# EAGLE schematic untitled (EAGLE 6.1)
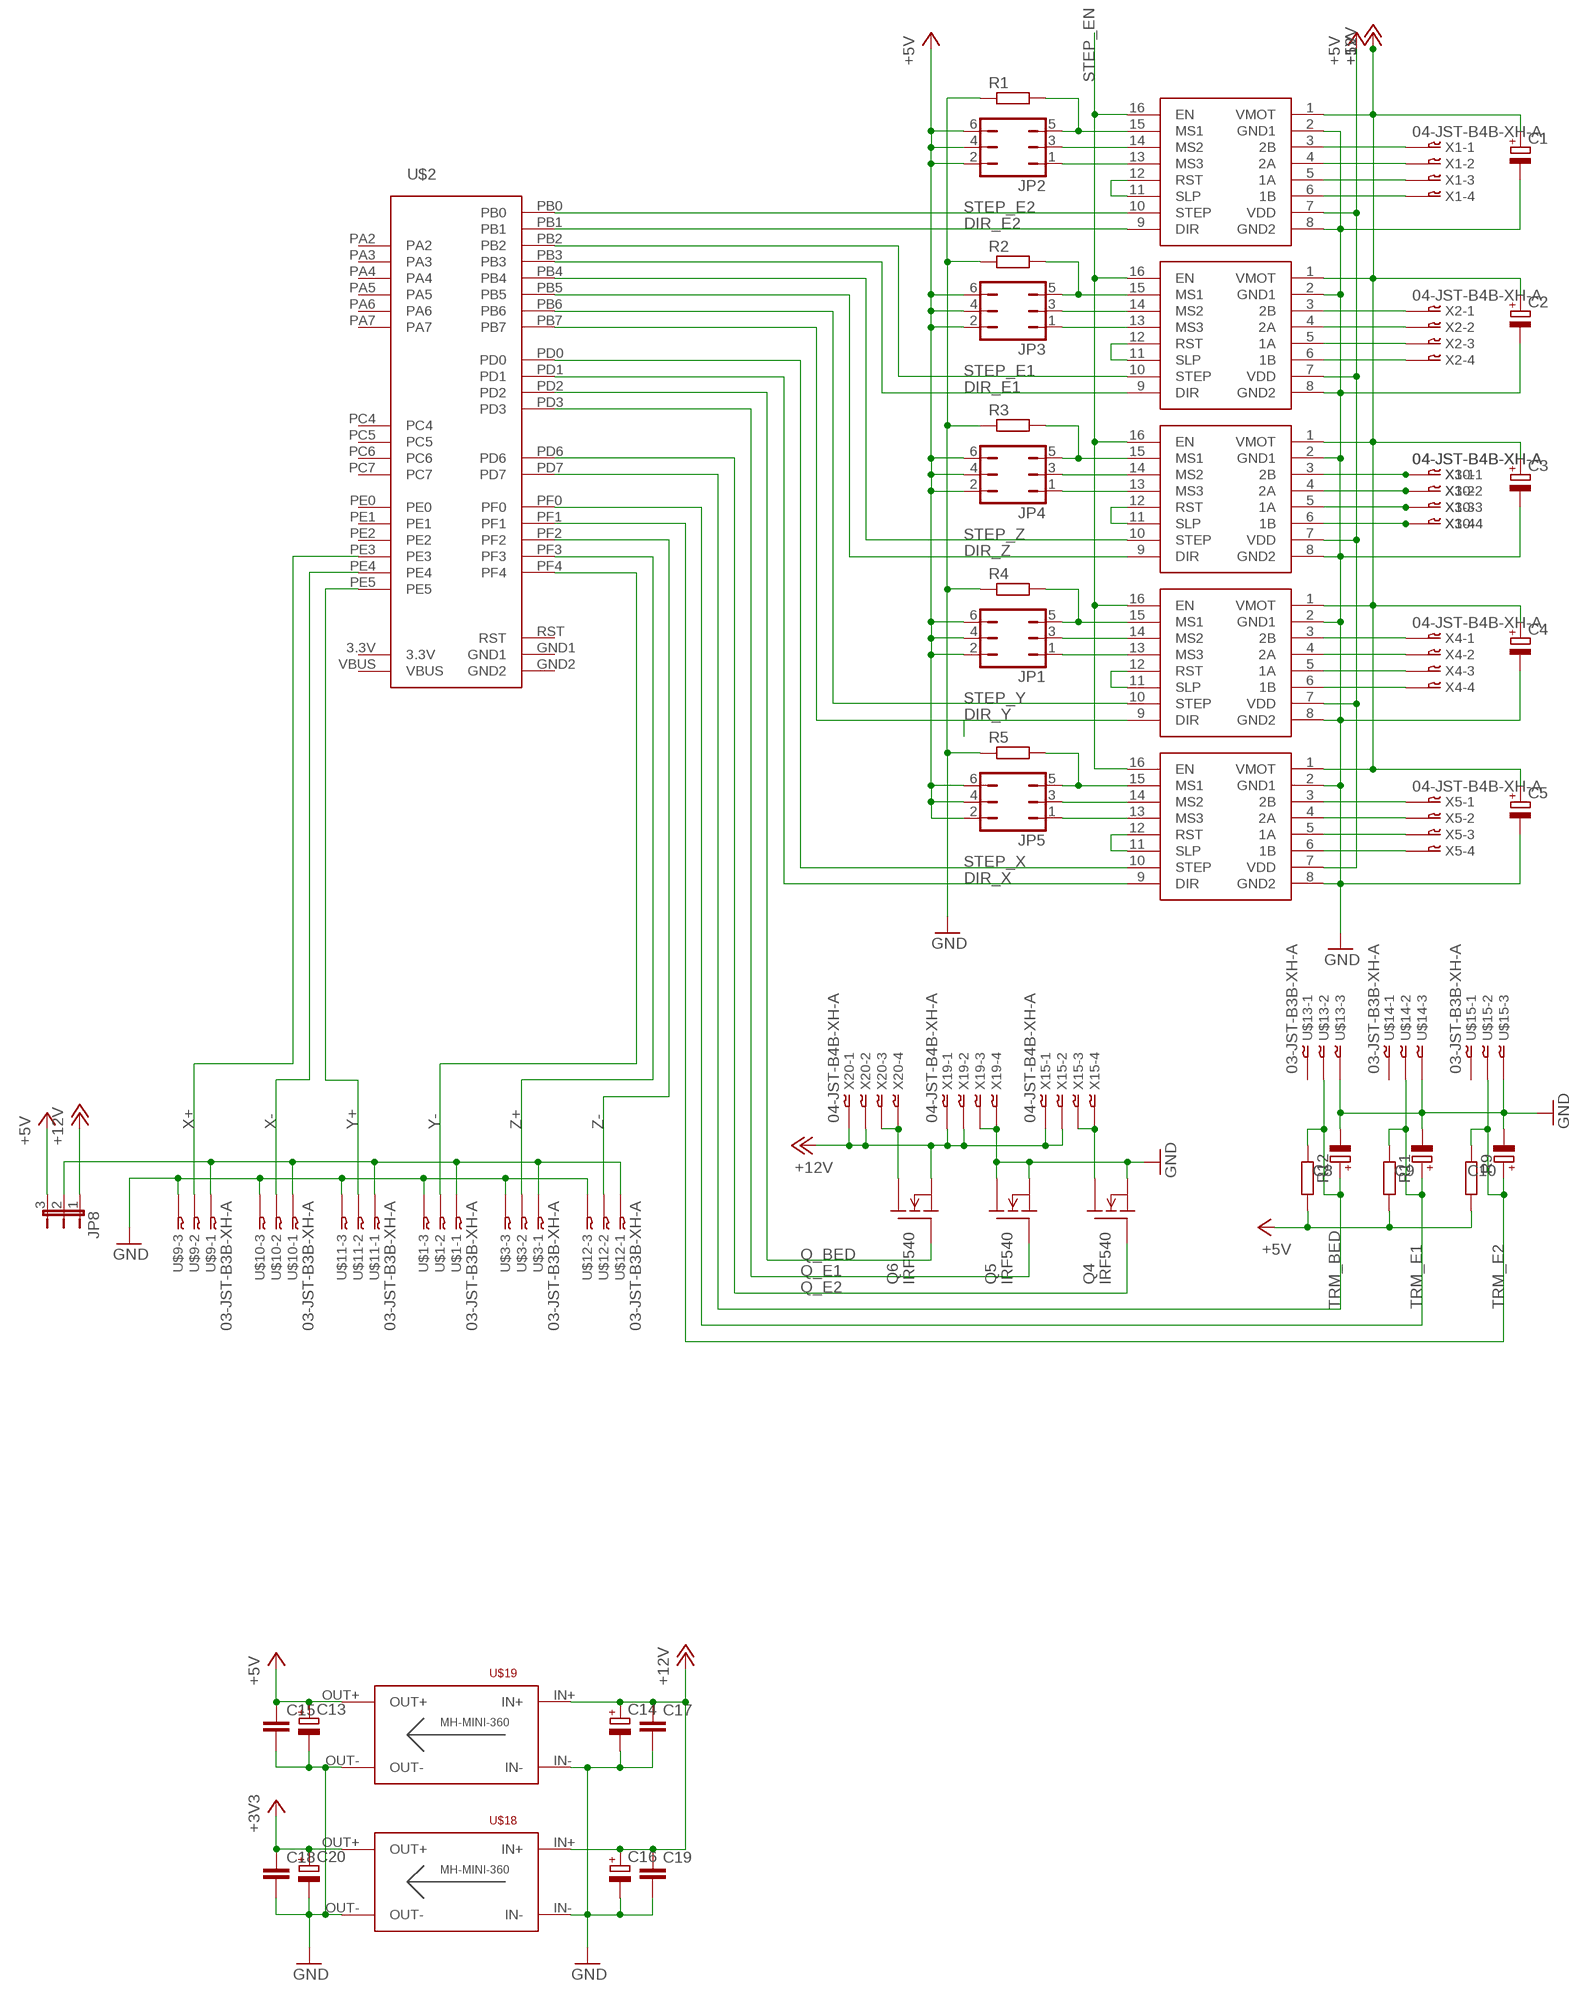
[diagram p0: schematic, sheet 1]

## Parts
C1  CPOL-EUE2.5-7  [E2,5-7]
C2  CPOL-EUE2.5-7  [E2,5-7]
C3  CPOL-EUE2.5-7  [E2,5-7]
C4  CPOL-EUE2.5-7  [E2,5-7]
C5  CPOL-EUE2.5-7  [E2,5-7]
C8  CPOL-EUE2.5-5  [E2,5-5]
C9  CPOL-EUE2.5-5  [E2,5-5]
C10  CPOL-EUE2.5-5  [E2,5-5]
C13  CPOL-EUE2.5-5  [E2,5-5]
C14  CPOL-EUE2.5-5  [E2,5-5]
C15  C-EU025-025X050  [C025-025X050]
C16  CPOL-EUE2.5-5  [E2,5-5]
C17  C-EU025-025X050  [C025-025X050]
C18  C-EU025-025X050  [C025-025X050]
C19  C-EU025-025X050  [C025-025X050]
C20  CPOL-EUE2.5-5  [E2,5-5]
JP1  JP3Q  [JP3Q]
JP2  JP3Q  [JP3Q]
JP3  JP3Q  [JP3Q]
JP4  JP3Q  [JP3Q]
JP5  JP3Q  [JP3Q]
JP8  JP2E  [JP2]
Q4  IRF540  [TO220]
Q5  IRF540  [TO220]
Q6  IRF540  [TO220]
R1  R-EU_0204/7  [0204/7]
R2  R-EU_0204/7  [0204/7]
R3  R-EU_0204/7  [0204/7]
R4  R-EU_0204/7  [0204/7]
R5  R-EU_0204/7  [0204/7]
R9  R-EU_0204/7  [0204/7]
R11  R-EU_0204/7  [0204/7]
R12  R-EU_0204/7  [0204/7]
U$1  03-JST-B3B-XH-A  [B3B-XH]
U$2  STELLARIS-LAUNCHPADSTELLARIS-LAUNCHPAD  [LAUNCHPAD-XL]
U$3  03-JST-B3B-XH-A  [B3B-XH]
U$4  POLOLUESTEPPERDRIVER  [DIL16]
U$5  POLOLUESTEPPERDRIVER  [DIL16]
U$6  POLOLUESTEPPERDRIVER  [DIL16]
U$7  POLOLUESTEPPERDRIVER  [DIL16]
U$8  POLOLUESTEPPERDRIVER  [DIL16]
U$9  03-JST-B3B-XH-A  [B3B-XH]
U$10  03-JST-B3B-XH-A  [B3B-XH]
U$11  03-JST-B3B-XH-A  [B3B-XH]
U$12  03-JST-B3B-XH-A  [B3B-XH]
U$13  03-JST-B3B-XH-A  [B3B-XH]
U$14  03-JST-B3B-XH-A  [B3B-XH]
U$15  03-JST-B3B-XH-A  [B3B-XH]
U$18  DC-DC_CONV_MINISTD  [DC-DC_CONV_MINI]
U$19  DC-DC_CONV_MINISTD  [DC-DC_CONV_MINI]
X1  04-JST-B4B-XH-A  [B4B-XH]
X2  04-JST-B4B-XH-A  [B4B-XH]
X3  04-JST-B4B-XH-A  [B4B-XH]
X4  04-JST-B4B-XH-A  [B4B-XH]
X5  04-JST-B4B-XH-A  [B4B-XH]
X10  04-JST-B4B-XH-A  [B4B-XH]
X15  04-JST-B4B-XH-A  [B4B-XH]
X19  04-JST-B4B-XH-A  [B4B-XH]
X20  04-JST-B4B-XH-A  [B4B-XH]

## Nets
+3V3: C18.1 C20.+ U$18.OUT+
+5V: C13.+ C15.1 JP1.2 JP1.4 JP1.6 JP2.2 JP2.4 JP2.6 JP3.2 JP3.4 JP3.6 JP4.2 JP4.4 JP4.6 JP5.2 JP5.4 JP5.6 JP8.3 R9.2 R11.2 R12.2 U$4.7(VDD) U$5.7(VDD) U$6.7(VDD) U$7.7(VDD) U$8.7(VDD) U$19.OUT+
+12V: C1.+ C2.+ C3.+ C4.+ C5.+ C14.+ C16.+ C17.1 C19.1 JP8.1 Q6.3(S) U$4.1(VMOT) U$5.1(VMOT) U$6.1(VMOT) U$7.1(VMOT) U$8.1(VMOT) U$18.IN+ U$19.IN+ X15.P$1 X15.P$2 X19.P$1 X19.P$2 X20.P$1 X20.P$2 ; supply symbol labelled +5V
DIR_E1: U$2.PB3 U$7.9(DIR)
DIR_E2: U$2.PB1 U$8.9(DIR)
DIR_X: U$2.PD1 U$4.9(DIR)
DIR_Y: U$5.9(DIR)
DIR_Z: U$2.PB5 U$6.9(DIR)
GND: C1.- C2.- C3.- C4.- C5.- C8.- C9.- C10.- C13.- C14.- C15.2 C16.- C17.2 C18.2 C19.2 C20.- Q4.3(S) Q5.2(D) Q5.3(S) R1.1 R2.1 R3.1 R4.1 R5.1 U$1.P$3 U$3.P$3 U$4.2(GND1) U$4.8(GND2) U$5.2(GND1) U$5.8(GND2) U$6.2(GND1) U$6.8(GND2) U$7.2(GND1) U$7.8(GND2) U$8.2(GND1) U$8.8(GND2) U$9.P$3 U$10.P$3 U$11.P$3 U$12.P$3 U$13.P$3 U$14.P$3 U$15.P$3 U$18.IN- U$18.OUT- U$19.IN- U$19.OUT- X19.P$3 X19.P$4
N$1: JP1.1 U$5.13(MS3)
N$2: JP1.3 U$5.14(MS2)
N$3: JP1.5 R4.2 U$5.15(MS1)
N$4: U$8.11(SLP) U$8.12(RST)
N$5: U$7.11(SLP) U$7.12(RST)
N$6: U$6.11(SLP) U$6.12(RST)
N$7: U$5.11(SLP) U$5.12(RST)
N$8: U$4.11(SLP) U$4.12(RST)
N$12: JP2.1 U$8.13(MS3)
N$13: JP2.3 U$8.14(MS2)
N$14: JP2.5 R1.2 U$8.15(MS1)
N$15: JP3.1 U$7.13(MS3)
N$16: JP3.3 U$7.14(MS2)
N$17: JP3.5 R2.2 U$7.15(MS1)
N$18: JP4.1 U$6.13(MS3)
N$19: JP4.3 U$6.14(MS2)
N$20: JP4.5 R3.2 U$6.15(MS1)
N$21: JP5.1 U$4.13(MS3)
N$22: JP5.3 U$4.14(MS2)
N$23: JP5.5 R5.2 U$4.15(MS1)
N$27: U$2.PB7
N$37: U$8.3(2B) X1.P$1
N$38: U$8.4(2A) X1.P$2
N$39: U$8.5(1A) X1.P$3
N$40: U$8.6(1B) X1.P$4
N$41: U$7.3(2B) X2.P$1
N$42: U$7.4(2A) X2.P$2
N$43: U$7.5(1A) X2.P$3
N$44: U$7.6(1B) X2.P$4
N$45: U$6.3(2B) X3.P$1 X10.P$1
N$46: U$6.4(2A) X3.P$2 X10.P$2
N$47: U$6.5(1A) X3.P$3 X10.P$3
N$48: U$6.6(1B) X3.P$4 X10.P$4
N$49: U$5.3(2B) X4.P$1
N$50: U$5.4(2A) X4.P$2
N$51: U$5.5(1A) X4.P$3
N$52: U$5.6(1B) X4.P$4
N$53: U$4.3(2B) X5.P$1
N$54: U$4.4(2A) X5.P$2
N$55: U$4.5(1A) X5.P$3
N$56: U$4.6(1B) X5.P$4
N$66: JP8.2 U$1.P$1 U$3.P$1 U$9.P$1 U$10.P$1 U$11.P$1 U$12.P$1
N$69: Q4.2(D) X15.P$3 X15.P$4
N$76: Q6.2(D) X20.P$3 X20.P$4
Q_BED: Q6.1(G) U$2.PD2
Q_E1: Q5.1(G) U$2.PD3
Q_E2: Q4.1(G) U$2.PD6
STEP_E1: U$2.PB2 U$7.10(STEP)
STEP_E2: U$2.PB0 U$8.10(STEP)
STEP_EN: U$4.16(EN) U$5.16(EN) U$6.16(EN) U$7.16(EN) U$8.16(EN)
STEP_X: U$2.PD0 U$4.10(STEP)
STEP_Y: U$2.PB6 U$5.10(STEP)
STEP_Z: U$2.PB4 U$6.10(STEP)
TRM_BED: C8.+ R12.1 U$2.PD7 U$13.P$2
TRM_E1: C9.+ R11.1 U$2.PF0 U$14.P$2
TRM_E2: C10.+ R9.1 U$2.PF1 U$15.P$2
X+: U$2.PE3 U$9.P$2
X-: U$2.PE4 U$10.P$2
Y+: U$2.PE5 U$11.P$2
Y-: U$1.P$2 U$2.PF4
Z+: U$2.PF3 U$3.P$2
Z-: U$2.PF2 U$12.P$2
Unconnected: U$2.GND1 U$2.PA2 U$2.PA3 U$2.PA4 U$2.PA5 U$2.PA6 U$2.PA7 U$2.PC4 U$2.PC5 U$2.PC6 U$2.PC7 U$2.PE0 U$2.PE1 U$2.PE2 U$13.P$1 U$14.P$1 U$15.P$1

## Power pins joined to a net without a drawn wire
3.3V: U$2.3.3V
GND2: U$2.GND2
RST: U$2.RST
VBUS: U$2.VBUS

## Library data of the parts
C1-C5 C8-C10 C13 C14 C16 C20 = rcl:CPOL-EU: POLARIZED CAPACITOR, European symbol
C15 C17-C19 = rcl:C-EU: CAPACITOR, European symbol
JP1-JP5 = jumper:JP3Q: JUMPER
JP8 = jumper:JP2E: JUMPER
Q4-Q6 = transistor-fet:IRF540: N-Channel Enhancement MOSFET (HEXFET); 100V; 28A; 0,077Ohm
R1-R5 R9 R11 R12 = rcl:R-EU_: RESISTOR, European symbol
U$1 U$3 U$9-U$15 = bt_con-jst-xh:03-JST: JST CONNECTOR
U$2 = fabhack:STELLARIS-LAUNCHPAD: Stellaris Launchpad LM4F120 using all header pins to connect to XL booster packs.
U$4-U$8 = reprap:POLOLUESTEPPERDRIVER: Pololu stepper driver based on the A4983.
U$18 U$19 = _MY_OWN_LIB:DC-DC_CONV_MINI
X1-X5 X10 X15 X19 X20 = bt_con-jst-xh:04-JST: JST CONNECTOR